# Altium schematic sheet Cover_sheet.SchDoc: Cover Sheet
size A4; Date: 23.10.2016; DrawnBy: Matjaz Tome; Engineer: Matjaz Tome; DocumentNumber: 1; Revision: B1; SheetNumber: 1; SheetTotal: 8; Project: USB DAQ
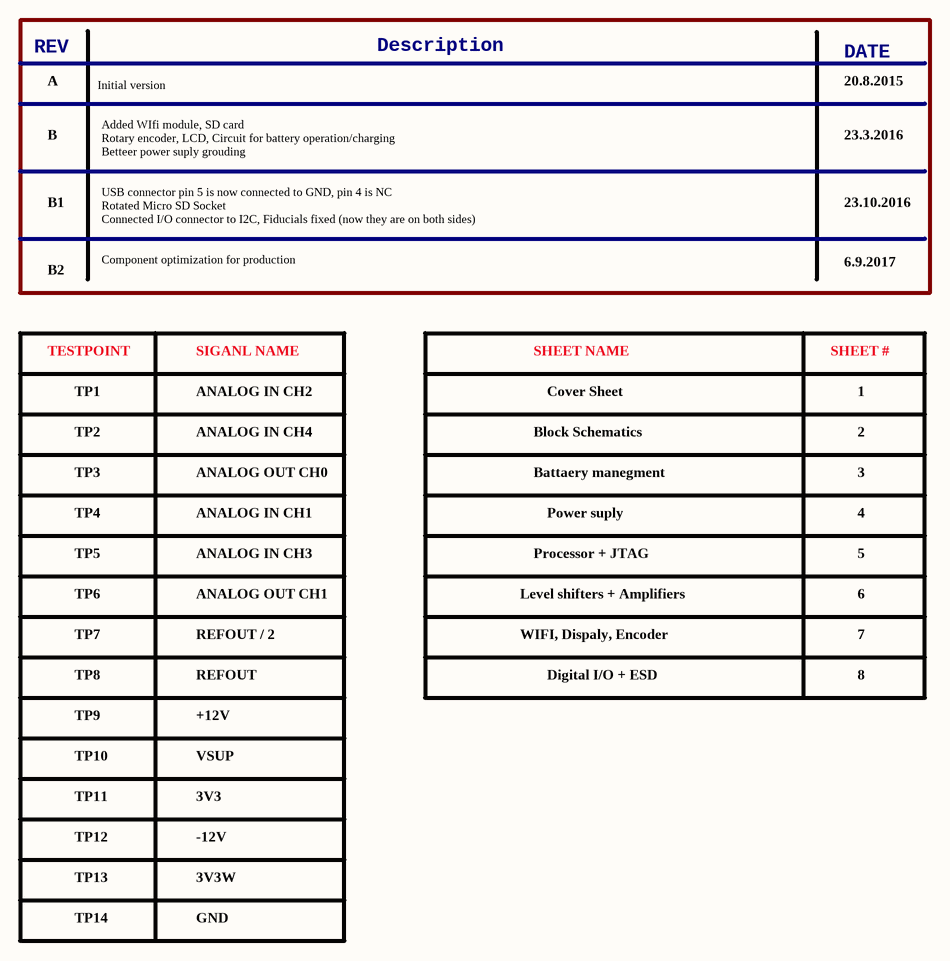
[diagram p0: Cover_sheet.SchDoc]

## Notes on the sheet
- REV
- Description
- DATE
- A
- Initial version
- 20.8.2015
- B
- Added WIfi module, SD card
  Rotary encoder, LCD, Circuit for battery operation/charging
  Betteer power suply grouding
- 23.3.2016
- B1
- USB connector pin 5 is now connected to GND, pin 4 is NC
  Rotated Micro SD Socket
  Connected I/O connector to I2C, Fiducials fixed (now they are on both sides)
- 23.10.2016
- 6.9.2017
- B2
- Component optimization for production
- TESTPOINT
- TP1
- SIGANL NAME
- ANALOG IN CH2
- SHEET NAME
- Cover Sheet
- SHEET #
- 1
- TP2
- ANALOG IN CH4
- Block Schematics
- 2
- TP3
- TP4
- ANALOG IN CH1
- ANALOG OUT CH0
- Battaery manegment
- Power suply
- 3
- 4
- TP5
- TP6
- ANALOG IN CH3
- ANALOG OUT CH1
- Level shifters + Amplifiers
- Processor + JTAG
- 5
- 6
- TP7
- REFOUT / 2
- WIFI, Dispaly, Encoder
- 7
- TP8
- TP9
- REFOUT
- +12V
- Digital I/O + ESD
- 8
- TP10
- TP11
- VSUP
- 3V3
- TP12
- -12V
- TP13
- TP14
- 3V3W
- GND
- Title
- Date
- Project
- Rev
- Engineer
- Sheet
- of